# Altium schematic sheet Mother Board NRF24L01.SchDoc
size A4
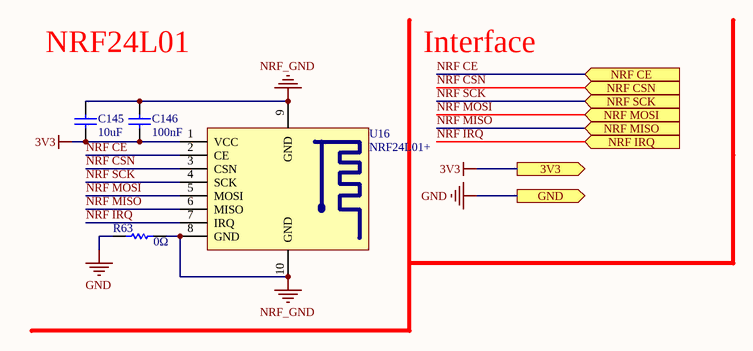
[diagram p0: Mother Board NRF24L01.SchDoc]

## Parts
C145  10uF  [C0805]
C146  100nF  [C0603]
R63  0Ω  [R0603]
U16  NRF24L01+  [NRF24L01+]

## Ports
3V3 (out), GND (out), NRF CE (in), NRF CSN (in), NRF IRQ (in), NRF MISO (in), NRF MOSI (in), NRF SCK (in)

## Nets
3V3: C145.1 C146.1 U16.1(VCC) ; port 3V3
GND: R63.2 ; port GND
NRF_GND: C145.2 C146.2 R63.1 U16.8(GND) U16.9(GND) U16.10(GND)
NRF CE: U16.2(CE) ; port NRF CE
NRF CSN: U16.3(CSN) ; port NRF CSN
NRF IRQ: U16.7(IRQ) ; port NRF IRQ
NRF MISO: U16.6(MISO) ; port NRF MISO
NRF MOSI: U16.5(MOSI) ; port NRF MOSI
NRF SCK: U16.4(SCK) ; port NRF SCK

## Notes on the sheet
- NRF24L01
- Interface

## Library data of the parts
C145 C146 = Cap
R63 = RES